# Altium schematic sheet ZB2.SchDoc
size A3; SheetNumber: 2; SheetTotal: 3; ENG_APP_DATE: --/--/--; DSN_APP_DATE: --/--/--; CHK_APP_DATE: --/--/--
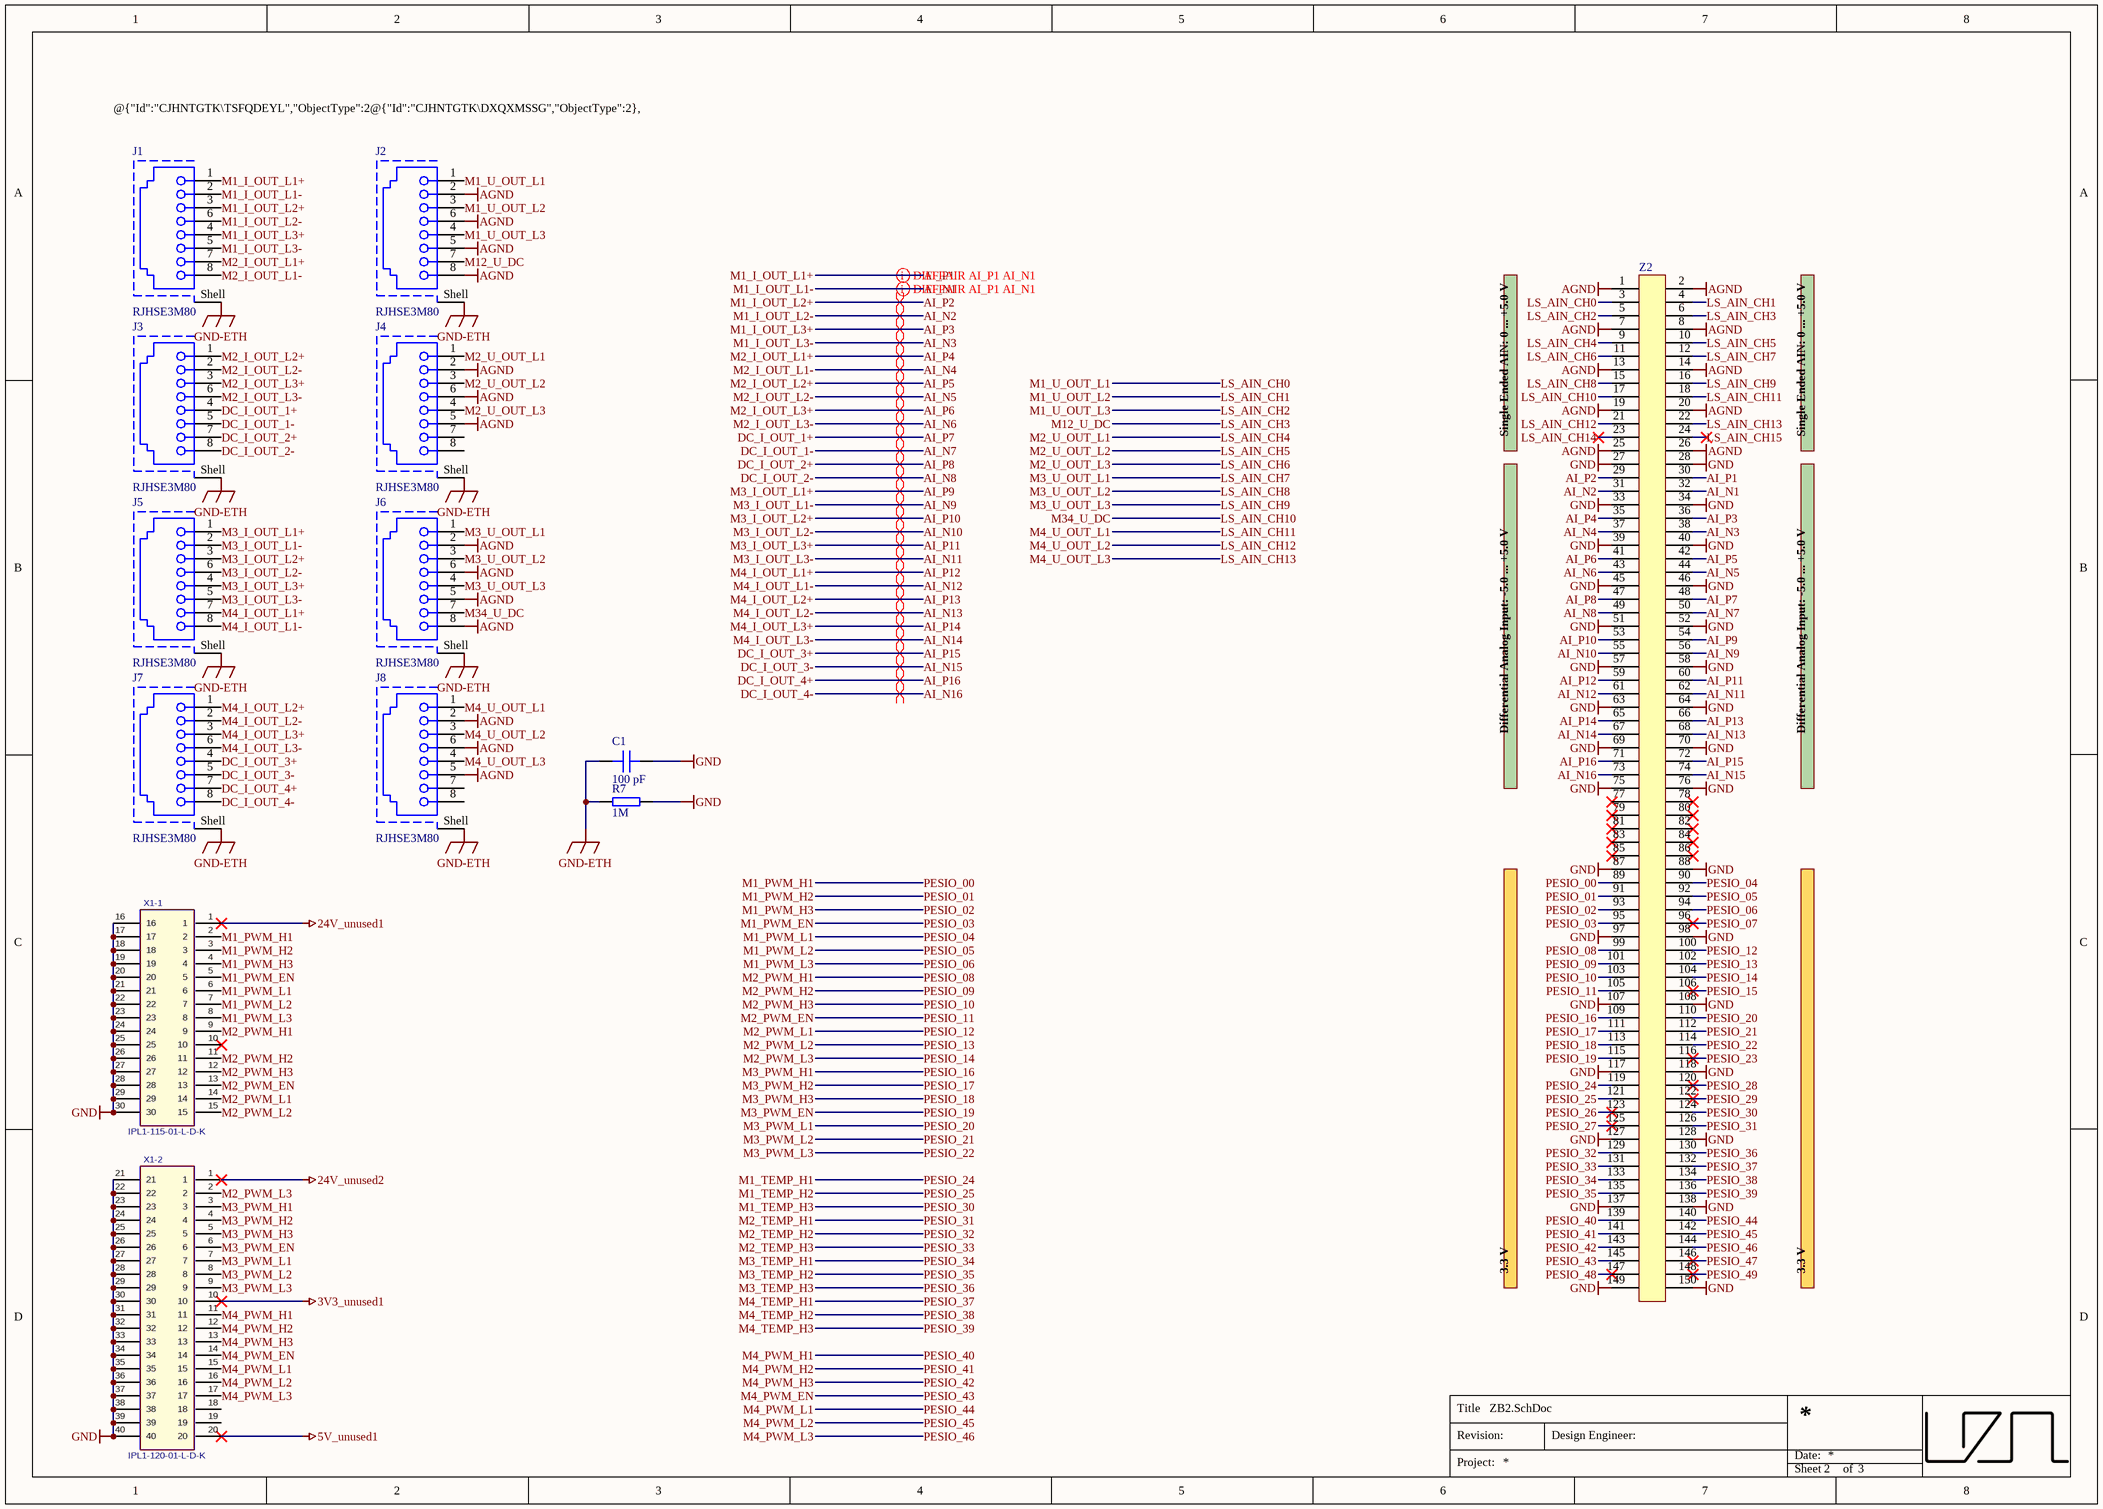
[diagram p0: ZB2.SchDoc]

## Parts
C1  100 pF  [C_1206_TE]
J1  RJHSE3M80  [RJHSE3M80]
J2  RJHSE3M80  [RJHSE3M80]
J3  RJHSE3M80  [RJHSE3M80]
J4  RJHSE3M80  [RJHSE3M80]
J5  RJHSE3M80  [RJHSE3M80]
J6  RJHSE3M80  [RJHSE3M80]
J7  RJHSE3M80  [RJHSE3M80]
J8  RJHSE3M80  [RJHSE3M80]
R7  1M  [RES 1206_3216]
X1-1  IPL1-115-01-L-D-K  [IPL1-115-01-YYY-D-K]
X1-2  IPL1-120-01-L-D-K  [SAMTEC_IPL1-120-01-X-D-K]
Z2  (no value)  [ERM8-075-02.0-L-DV]

## Nets
3V3_unused1: X1-2.10
5V_unused1: X1-2.20
24V_unused1: X1-1.1
24V_unused2: X1-2.1
AGND: J2.2 J2.5 J2.6 J2.8 J4.2 J4.5 J4.6 J6.2 J6.5 J6.6 J6.8 J8.2 J8.5 J8.6 Z2.1 Z2.2 Z2.7 Z2.8 Z2.13 Z2.14 Z2.19 Z2.20 Z2.25 Z2.26
GND: C1.2 R7.2 X1-1.16 X1-1.17 X1-1.18 X1-1.19 X1-1.20 X1-1.21 X1-1.22 X1-1.23 X1-1.24 X1-1.25 X1-1.26 X1-1.27 X1-1.28 X1-1.29 X1-1.30 X1-2.21 X1-2.22 X1-2.23 X1-2.24 X1-2.25 X1-2.26 X1-2.27 X1-2.28 X1-2.29 X1-2.30 X1-2.31 X1-2.32 X1-2.33 X1-2.34 X1-2.35 X1-2.36 X1-2.37 X1-2.38 X1-2.39 X1-2.40 Z2.27 Z2.28 Z2.33 Z2.34 Z2.39 Z2.40 Z2.45 Z2.46 Z2.51 Z2.52 Z2.57 Z2.58 Z2.63 Z2.64 Z2.69 Z2.70 Z2.75 Z2.76 Z2.87 Z2.88 Z2.97 Z2.98 Z2.107 Z2.108 Z2.117 Z2.118 Z2.127 Z2.128 Z2.137 Z2.138 Z2.149 Z2.150
GND-ETH: C1.1 J1.Shell J2.Shell J3.Shell J4.Shell J5.Shell J6.Shell J7.Shell J8.Shell R7.1
AI_N1: J1.2 Z2.32  [also labelled M1_I_OUT_L1-]
AI_N2: J1.6 Z2.31  [also labelled M1_I_OUT_L2-]
AI_N3: J1.5 Z2.38  [also labelled M1_I_OUT_L3-]
AI_N4: J1.8 Z2.37  [also labelled M2_I_OUT_L1-]
AI_N5: J3.2 Z2.44  [also labelled M2_I_OUT_L2-]
AI_N6: J3.6 Z2.43  [also labelled M2_I_OUT_L3-]
AI_N7: J3.5 Z2.50  [also labelled DC_I_OUT_1-]
AI_N8: J3.8 Z2.49  [also labelled DC_I_OUT_2-]
AI_N9: J5.2 Z2.56  [also labelled M3_I_OUT_L1-]
AI_N10: J5.6 Z2.55  [also labelled M3_I_OUT_L2-]
AI_N11: J5.5 Z2.62  [also labelled M3_I_OUT_L3-]
AI_N12: J5.8 Z2.61  [also labelled M4_I_OUT_L1-]
AI_N13: J7.2 Z2.68  [also labelled M4_I_OUT_L2-]
AI_N14: J7.6 Z2.67  [also labelled M4_I_OUT_L3-]
AI_N15: J7.5 Z2.74  [also labelled DC_I_OUT_3-]
AI_N16: J7.8 Z2.73  [also labelled DC_I_OUT_4-]
AI_P1: J1.1 Z2.30  [also labelled M1_I_OUT_L1+]
AI_P2: J1.3 Z2.29  [also labelled M1_I_OUT_L2+]
AI_P3: J1.4 Z2.36  [also labelled M1_I_OUT_L3+]
AI_P4: J1.7 Z2.35  [also labelled M2_I_OUT_L1+]
AI_P5: J3.1 Z2.42  [also labelled M2_I_OUT_L2+]
AI_P6: J3.3 Z2.41  [also labelled M2_I_OUT_L3+]
AI_P7: J3.4 Z2.48  [also labelled DC_I_OUT_1+]
AI_P8: J3.7 Z2.47  [also labelled DC_I_OUT_2+]
AI_P9: J5.1 Z2.54  [also labelled M3_I_OUT_L1+]
AI_P10: J5.3 Z2.53  [also labelled M3_I_OUT_L2+]
AI_P11: J5.4 Z2.60  [also labelled M3_I_OUT_L3+]
AI_P12: J5.7 Z2.59  [also labelled M4_I_OUT_L1+]
AI_P13: J7.1 Z2.66  [also labelled M4_I_OUT_L2+]
AI_P14: J7.3 Z2.65  [also labelled M4_I_OUT_L3+]
AI_P15: J7.4 Z2.72  [also labelled DC_I_OUT_3+]
AI_P16: J7.7 Z2.71  [also labelled DC_I_OUT_4+]
LS_AIN_CH0: J2.1 Z2.3  [also labelled M1_U_OUT_L1]
LS_AIN_CH1: J2.3 Z2.4  [also labelled M1_U_OUT_L2]
LS_AIN_CH2: J2.4 Z2.5  [also labelled M1_U_OUT_L3]
LS_AIN_CH3: J2.7 Z2.6  [also labelled M12_U_DC]
LS_AIN_CH4: J4.1 Z2.9  [also labelled M2_U_OUT_L1]
LS_AIN_CH5: J4.3 Z2.10  [also labelled M2_U_OUT_L2]
LS_AIN_CH6: J4.4 Z2.11  [also labelled M2_U_OUT_L3]
LS_AIN_CH7: J6.1 Z2.12  [also labelled M3_U_OUT_L1]
LS_AIN_CH8: J6.3 Z2.15  [also labelled M3_U_OUT_L2]
LS_AIN_CH9: J6.4 Z2.16  [also labelled M3_U_OUT_L3]
LS_AIN_CH10: J6.7 Z2.17  [also labelled M34_U_DC]
LS_AIN_CH11: J8.1 Z2.18  [also labelled M4_U_OUT_L1]
LS_AIN_CH12: J8.3 Z2.21  [also labelled M4_U_OUT_L2]
LS_AIN_CH13: J8.4 Z2.22  [also labelled M4_U_OUT_L3]
LS_AIN_CH14: Z2.23
LS_AIN_CH15: Z2.24
M1_PWM_EN: X1-1.5 Z2.95  [also labelled PESIO_03]
M1_PWM_H1: X1-1.2 Z2.89  [also labelled PESIO_00]
M1_PWM_H2: X1-1.3 Z2.91  [also labelled PESIO_01]
M1_PWM_H3: X1-1.4 Z2.93  [also labelled PESIO_02]
M1_PWM_L1: X1-1.6 Z2.90  [also labelled PESIO_04]
M1_PWM_L2: X1-1.7 Z2.92  [also labelled PESIO_05]
M1_PWM_L3: X1-1.8 Z2.94  [also labelled PESIO_06]
M1_TEMP_H1: Z2.119  [also labelled PESIO_24]
M1_TEMP_H2: Z2.121  [also labelled PESIO_25]
M1_TEMP_H3: Z2.124  [also labelled PESIO_30]
M2_PWM_EN: X1-1.13 Z2.105  [also labelled PESIO_11]
M2_PWM_H1: X1-1.9 Z2.99  [also labelled PESIO_08]
M2_PWM_H2: X1-1.11 Z2.101  [also labelled PESIO_09]
M2_PWM_H3: X1-1.12 Z2.103  [also labelled PESIO_10]
M2_PWM_L1: X1-1.14 Z2.100  [also labelled PESIO_12]
M2_PWM_L2: X1-1.15 Z2.102  [also labelled PESIO_13]
M2_PWM_L3: X1-2.2 Z2.104  [also labelled PESIO_14]
M2_TEMP_H1: Z2.126  [also labelled PESIO_31]
M2_TEMP_H2: Z2.129  [also labelled PESIO_32]
M2_TEMP_H3: Z2.131  [also labelled PESIO_33]
M3_PWM_EN: X1-2.6 Z2.115  [also labelled PESIO_19]
M3_PWM_H1: X1-2.3 Z2.109  [also labelled PESIO_16]
M3_PWM_H2: X1-2.4 Z2.111  [also labelled PESIO_17]
M3_PWM_H3: X1-2.5 Z2.113  [also labelled PESIO_18]
M3_PWM_L1: X1-2.7 Z2.110  [also labelled PESIO_20]
M3_PWM_L2: X1-2.8 Z2.112  [also labelled PESIO_21]
M3_PWM_L3: X1-2.9 Z2.114  [also labelled PESIO_22]
M3_TEMP_H1: Z2.133  [also labelled PESIO_34]
M3_TEMP_H2: Z2.135  [also labelled PESIO_35]
M3_TEMP_H3: Z2.130  [also labelled PESIO_36]
M4_PWM_EN: X1-2.14 Z2.145  [also labelled PESIO_43]
M4_PWM_H1: X1-2.11 Z2.139  [also labelled PESIO_40]
M4_PWM_H2: X1-2.12 Z2.141  [also labelled PESIO_41]
M4_PWM_H3: X1-2.13 Z2.143  [also labelled PESIO_42]
M4_PWM_L1: X1-2.15 Z2.140  [also labelled PESIO_44]
M4_PWM_L2: X1-2.16 Z2.142  [also labelled PESIO_45]
M4_PWM_L3: X1-2.17 Z2.144  [also labelled PESIO_46]
M4_TEMP_H1: Z2.132  [also labelled PESIO_37]
M4_TEMP_H2: Z2.134  [also labelled PESIO_38]
M4_TEMP_H3: Z2.136  [also labelled PESIO_39]
PESIO_07: Z2.96
PESIO_15: Z2.106
PESIO_23: Z2.116
PESIO_26: Z2.123
PESIO_27: Z2.125
PESIO_28: Z2.120
PESIO_29: Z2.122
PESIO_47: Z2.146
PESIO_48: Z2.147
PESIO_49: Z2.148

Not connected (* = marked no-connect by the designer): J4 7 8; J8 7 8; X1-1 10*; X1-2 18 19; Z2 77* 78* 79* 80* 81* 82* 83* 84* 85* 86*

## Layout directives
differential pair: AI_N1, AI_N2, AI_N3, AI_N4, AI_N5, AI_N6, AI_N7, AI_N8, AI_N9, AI_N10, AI_N11, AI_N12, AI_N13, AI_N14, AI_N15, AI_N16, AI_P1, AI_P2, AI_P3, AI_P4, AI_P5, AI_P6, AI_P7, AI_P8, AI_P9, AI_P10, AI_P11, AI_P12, AI_P13, AI_P14, AI_P15, AI_P16

## Notes on the sheet
- @{"Id":"CJHNTGTK\TSFQDEYL","ObjectType":2}, @{"Id":"CJHNTGTK\HTRMMLFJ","ObjectType":2}, @{"Id":"CJHNTGTK\ANRNPEXK","ObjectType":2}, @{"Id":"CJHNTGTK\OAQMETMZ","ObjectType":2} geht auf LTC2325
- @{"Id":"CJHNTGTK\DXQXMSSG","ObjectType":2}, @{"Id":"CJHNTGTK\IYSWADTS","ObjectType":2}, @{"Id":"CJHNTGTK\YMBDAVPH","ObjectType":2}, @{"Id":"CJHNTGTK\LNKFKSJG","ObjectType":2} geht auf MAX11331
- Single Ended AIN: 0 ... +5.0 V
- Differential Analog Input: -5.0 ... +5.0 V
- 3.3 V
- Title
- Revision:
- Design Engineer:
- Date:
- Project:
- Sheet
- of

## Library data of the parts
C1 = CC1206JKNPODBN101: 2kV 100pF NP0 ±5% 1206 Multilayer Ceramic Capacitors MLCC - SMD/SMT ROHS; Manufacturer: YAGEO; Voltage Rating: 2000 VDC; Created from: AGeiger; Manufacturer Part Number: CC1206JKNPODBN101; PartID: 115; Created On: 02.12.2022 11:59:53; ComponentLink1Description: Datasheet; ComponentLink1URL: https://datasheet.lcsc.com/lcsc/2108131530_YAGEO-CC1206JKNPODBN101_C113876.pdf; Component Type: Capacitor 1206; Device Package: 1206; Last Updated: 22.04.2025 15:53:45; Mounting Type: SMD; Operating Temperature: -55 to +125°C; Series: NP0; Supplier 1: LCSC; Supplier Part Number 1: C113876; Type: Capacitor; Tolerance: 5 %; Value: 100 pF; Live Cycle Status: 1; LCSC Part Number: C113876
J1-J8 = RJHSE3M80: CAT5, RJ45 Connector, 1 port, vertical; Manufacturer: Amphenol; Created from: DHufnagel; Manufacturer Part Number: RJHSE3M80; PartID: 12; Created On: 06.06.2023 05:55:53; ComponentLink1Description: Datasheet; ComponentLink1URL: https://cdn.amphenol-cs.com/media/wysiwyg/files/documentation/datasheet/inputoutput/io-modjack-rjhse.pdf; Component Type: RJ45 Connector; Device Package: RJ45; Last Updated: 06.06.2023 05:55:53; Mounting Type: THT; Series: RJHSE; Supplier 1: Mouser; Supplier Part Number 1: 523-RJHSE3M80; Supplier 2: LCSC; Supplier Part Number 2: C3179193; Type: RJ45 Connector; Live Cycle Status: 1; LCSC Part Number: C3179193; Stock number: not stored
R7 = 1206W4F1004T5E: 250mW Thick Film Resistors 200V ±100ppm/℃ ±1% -55℃~+155℃ 1MΩ 1206 Chip Resistor - Surface Mount ROHS; Manufacturer: UNI-ROYAL; Created from: AGeiger; Manufacturer Part Number: 1206W4F1004T5E; PartID: 248; Created On: 02.12.2022 11:50:50; ComponentLink1Description: Datasheet; ComponentLink1URL: https://datasheet.lcsc.com/lcsc/2206010145_UNI-ROYAL-Uniroyal-Elec-1206W4F1004T5E_C17927.pdf; Component Type: SMD resistor; Device Package: 1206; Last Updated: 02.12.2022 11:50:50; Mounting Type: SMD; Supplier 1: LCSC; Supplier Part Number 1: C17927; Type: Resistor; Tolerance: 1%; Value: 1M; Live Cycle Status: 1; LCSC Part Number: C17927
X1-1 = IPL1-115-01-L-D-K: 2.54 mm Double Row Terminal Assembly; Manufacturer: SAMTEC; Created from: MGremer; Number of positions: 30; Manufacturer Part Number: IPL1-115-01-L-D-K; PartID: 28; Created On: 01.12.2020 18:14:32; ComponentLink1Description: Homepage; ComponentLink1URL: https://www.samtec.com/de/products/ipl1; Component Type: Samtec Connector; Device Package: Connector; Last Updated: 15.02.2021 10:08:03; Mounting Type: THT; Supplier 1: SAMTEC; Supplier Part Number 1: IPL1-115-01-L-D-K; Type: Connector; Live Cycle Status: 1; Number of rows: 2; Stock number: not stored
X1-2 = IPL1-120-01-L-D-K: Terminal Assembly, Double Row, Thru-Hole, 2.54 mm x 2.54 mm Pitch, 40 Pins; Manufacturer: SAMTEC; Created from: PBaumann; Number of positions: 40; Manufacturer Part Number: IPL1-120-01-L-D-K; PartID: 42; Created On: 24.03.2021 02:48:34; ComponentLink1Description: Homepage; ComponentLink1URL: https://www.samtec.com/products/ipl1; Component Type: Samtec Connector; Device Package: Connector; Last Updated: 27.05.2022 12:12:18; Mounting Type: THT; Supplier 1: SAMTEC; Supplier Part Number 1: IPL1-120-01-L-D-K; Type: Connector; Live Cycle Status: 1; Number of rows: 2; Stock number: not stored
Z2 = ERM8-075-02.0-L-DV-TR: 0.80 mm Edge Rate Rugged High Speed; Manufacturer: SAMTEC; Created from: AGeiger; Manufacturer Part Number: ERM8-075-02.0-L-DV-TR; PartID: 62; Created On: 15.08.2025 09:35:44; ComponentLink1Description: Datasheet; ComponentLink1URL: https://suddendocs.samtec.com/catalog_english/erm8.pdf; Last Updated: 23.09.2025 10:14:21; Mounting Type: SMD; Operating Temperature: -55 °C to +125 °C; Series: ERM8; Supplier 1: LCSC; Supplier Part Number 1: C6845629; Value: ERM8-075-02.0-L-DV-TR; LCSC Part Number: C6845629